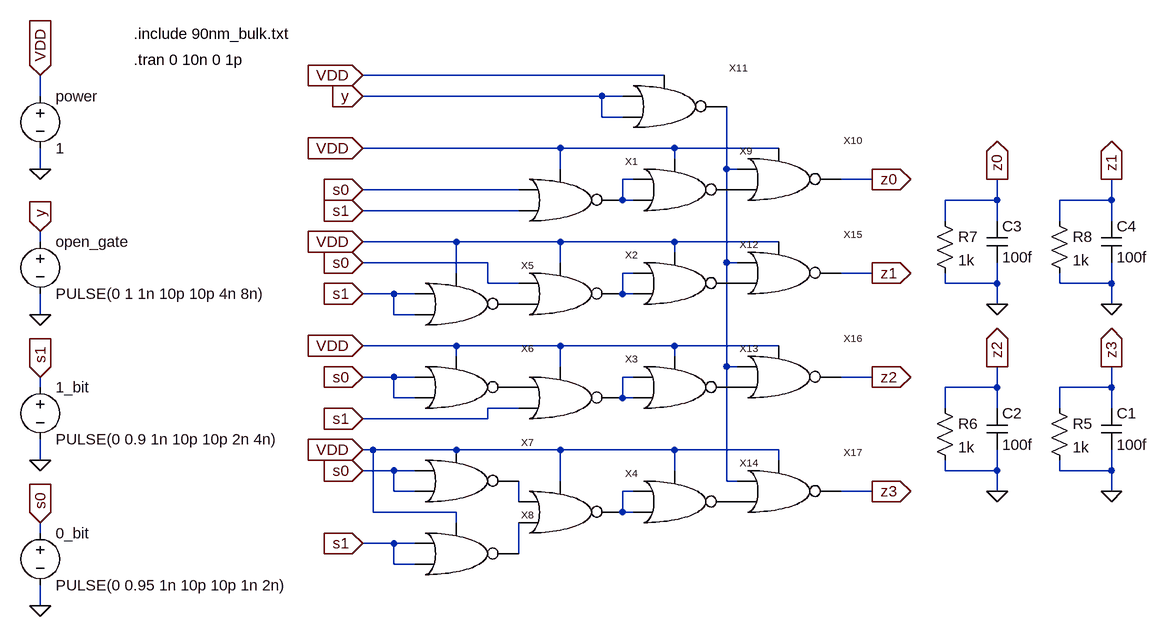
[diagram p0: schematic nor_demultiplexor.asc]
nor_demultiplexor.asc, the LTspice schematic file:
Version 4
SHEET 1 1288 680
WIRE 368 -416 -96 -416
WIRE -592 -384 -592 -416
WIRE 272 -384 -96 -384
WIRE 304 -384 272 -384
WIRE 272 -352 272 -384
WIRE 304 -352 272 -352
WIRE 208 -304 -96 -304
WIRE 384 -304 208 -304
WIRE 544 -304 384 -304
WIRE 384 -288 384 -304
WIRE -592 -272 -592 -304
WIRE 208 -272 208 -304
WIRE 464 -272 464 -368
WIRE 480 -272 464 -272
WIRE 320 -256 304 -256
WIRE 688 -256 640 -256
WIRE 144 -240 -96 -240
WIRE 304 -224 304 -256
WIRE 320 -224 304 -224
WIRE 880 -224 880 -256
WIRE 880 -224 800 -224
WIRE 1056 -224 1056 -256
WIRE 1056 -224 976 -224
WIRE 144 -208 -96 -208
WIRE 800 -192 800 -224
WIRE 880 -192 880 -224
WIRE 976 -192 976 -224
WIRE 1056 -192 1056 -224
WIRE -592 -160 -592 -176
WIRE 48 -160 -96 -160
WIRE 208 -160 48 -160
WIRE 384 -160 208 -160
WIRE 544 -160 384 -160
WIRE 384 -144 384 -160
WIRE 96 -128 -96 -128
WIRE 208 -128 208 -160
WIRE 464 -128 464 -272
WIRE 480 -128 464 -128
WIRE 48 -112 48 -160
WIRE 320 -112 304 -112
WIRE 688 -112 640 -112
WIRE 96 -96 96 -128
WIRE 144 -96 96 -96
WIRE 800 -96 800 -112
WIRE 880 -96 880 -128
WIRE 880 -96 800 -96
WIRE 976 -96 976 -112
WIRE 1056 -96 1056 -128
WIRE 1056 -96 976 -96
WIRE -48 -80 -96 -80
WIRE -16 -80 -48 -80
WIRE 304 -80 304 -112
WIRE 320 -80 304 -80
WIRE 880 -64 880 -96
WIRE 1056 -64 1056 -96
WIRE -592 -48 -592 -80
WIRE -48 -48 -48 -80
WIRE -16 -48 -48 -48
WIRE 48 0 -96 0
WIRE 208 0 48 0
WIRE 384 0 208 0
WIRE 544 0 384 0
WIRE 48 16 48 0
WIRE 384 16 384 0
WIRE 208 32 208 0
WIRE 464 32 464 -128
WIRE 480 32 464 32
WIRE -48 48 -96 48
WIRE -16 48 -48 48
WIRE 320 48 304 48
WIRE 688 48 640 48
WIRE -592 64 -592 48
WIRE 880 64 880 32
WIRE 880 64 800 64
WIRE 1056 64 1056 32
WIRE 1056 64 976 64
WIRE -48 80 -48 48
WIRE -16 80 -48 80
WIRE 304 80 304 48
WIRE 320 80 304 80
WIRE 144 96 96 96
WIRE 800 96 800 64
WIRE 880 96 880 64
WIRE 976 96 976 64
WIRE 1056 96 1056 64
WIRE 96 112 96 96
WIRE 96 112 -96 112
WIRE -80 160 -96 160
WIRE 48 160 -80 160
WIRE 208 160 48 160
WIRE 384 160 208 160
WIRE 544 160 384 160
WIRE -592 176 -592 144
WIRE 544 176 544 160
WIRE -48 192 -96 192
WIRE -16 192 -48 192
WIRE 384 192 384 160
WIRE 800 192 800 176
WIRE 880 192 880 160
WIRE 880 192 800 192
WIRE 976 192 976 176
WIRE 1056 192 1056 160
WIRE 1056 192 976 192
WIRE 208 208 208 160
WIRE 464 208 464 32
WIRE 480 208 464 208
WIRE -48 224 -48 192
WIRE -16 224 -48 224
WIRE 320 224 304 224
WIRE 688 224 640 224
WIRE 880 224 880 192
WIRE 1056 224 1056 192
WIRE 144 240 144 208
WIRE -80 256 -80 160
WIRE 48 256 -80 256
WIRE 304 256 304 224
WIRE 320 256 304 256
WIRE 48 272 48 256
WIRE -592 288 -592 272
WIRE -48 304 -96 304
WIRE -16 304 -48 304
WIRE 144 320 144 272
WIRE -48 336 -48 304
WIRE -16 336 -48 336
WIRE -592 400 -592 368
FLAG -96 -240 s0
IOPIN -96 -240 In
FLAG -96 -208 s1
IOPIN -96 -208 In
FLAG -592 400 0
FLAG -592 176 0
FLAG -592 -48 0
FLAG -96 -384 y
IOPIN -96 -384 In
FLAG -592 -176 y
IOPIN -592 -176 In
FLAG -592 272 s0
IOPIN -592 272 In
FLAG -592 48 s1
IOPIN -592 48 In
FLAG -96 -128 s0
IOPIN -96 -128 In
FLAG -96 -80 s1
IOPIN -96 -80 In
FLAG -592 -272 0
FLAG -592 -416 VDD
IOPIN -592 -416 In
FLAG -96 -304 VDD
IOPIN -96 -304 In
FLAG -96 -160 VDD
IOPIN -96 -160 In
FLAG -96 112 s1
IOPIN -96 112 In
FLAG -96 48 s0
IOPIN -96 48 In
FLAG -96 0 VDD
IOPIN -96 0 In
FLAG -96 192 s0
IOPIN -96 192 In
FLAG -96 304 s1
IOPIN -96 304 In
FLAG -96 160 VDD
IOPIN -96 160 In
FLAG 1056 224 0
FLAG 1056 32 z3
IOPIN 1056 32 Out
FLAG 880 224 0
FLAG 880 32 z2
IOPIN 880 32 Out
FLAG 880 -64 0
FLAG 880 -256 z0
IOPIN 880 -256 Out
FLAG 1056 -64 0
FLAG 1056 -256 z1
IOPIN 1056 -256 Out
FLAG 688 -256 z0
IOPIN 688 -256 Out
FLAG 688 -112 z1
IOPIN 688 -112 Out
FLAG 688 48 z2
IOPIN 688 48 Out
FLAG 688 224 z3
IOPIN 688 224 Out
FLAG -96 -416 VDD
IOPIN -96 -416 In
SYMBOL voltage -592 272 R0
WINDOW 123 0 0 Left 0
WINDOW 39 0 0 Left 0
SYMATTR InstName 0_bit
SYMATTR Value PULSE(0 0.95 1n 10p 10p 1n 2n)
SYMBOL voltage -592 -176 R0
WINDOW 123 0 0 Left 0
WINDOW 39 0 0 Left 0
SYMATTR InstName open_gate
SYMATTR Value PULSE(0 1 1n 10p 10p 4n 8n)
SYMBOL voltage -592 48 R0
WINDOW 123 0 0 Left 0
WINDOW 39 0 0 Left 0
SYMATTR InstName 1_bit
SYMATTR Value PULSE(0 0.9 1n 10p 10p 2n 4n)
SYMBOL nor_gate 192 -224 R0
SYMATTR InstName X1
SYMBOL nor_gate 192 -80 R0
SYMATTR InstName X2
SYMBOL nor_gate 192 80 R0
SYMATTR InstName X3
SYMBOL nor_gate 192 256 R0
SYMATTR InstName X4
SYMBOL nor_gate 32 -64 R0
SYMATTR InstName X5
SYMBOL voltage -592 -400 R0
WINDOW 123 0 0 Left 0
WINDOW 39 0 0 Left 0
SYMATTR InstName power
SYMATTR Value 1
SYMBOL nor_gate 32 64 R0
SYMATTR InstName X6
SYMBOL nor_gate 32 208 R0
SYMATTR InstName X7
SYMBOL nor_gate 32 320 R0
SYMATTR InstName X8
SYMBOL nor_gate 368 -240 R0
SYMATTR InstName X9
SYMBOL nor_gate 528 -256 R0
SYMATTR InstName X10
SYMBOL nor_gate 352 -368 R0
SYMATTR InstName X11
SYMBOL nor_gate 368 -96 R0
SYMATTR InstName X12
SYMBOL nor_gate 368 64 R0
SYMATTR InstName X13
SYMBOL nor_gate 368 240 R0
SYMATTR InstName X14
SYMBOL nor_gate 528 -112 R0
SYMATTR InstName X15
SYMBOL nor_gate 528 48 R0
SYMATTR InstName X16
SYMBOL nor_gate 528 224 R0
SYMATTR InstName X17
SYMBOL res 960 80 R0
SYMATTR InstName R5
SYMATTR Value 1k
SYMBOL cap 1040 96 R0
SYMATTR InstName C1
SYMATTR Value 100f
SYMBOL res 784 80 R0
SYMATTR InstName R6
SYMATTR Value 1k
SYMBOL cap 864 96 R0
SYMATTR InstName C2
SYMATTR Value 100f
SYMBOL res 784 -208 R0
SYMATTR InstName R7
SYMATTR Value 1k
SYMBOL cap 864 -192 R0
SYMATTR InstName C3
SYMATTR Value 100f
SYMBOL res 960 -208 R0
SYMATTR InstName R8
SYMATTR Value 1k
SYMBOL cap 1040 -192 R0
SYMATTR InstName C4
SYMATTR Value 100f
TEXT -448 -480 Left 2 !.include 90nm_bulk.txt
TEXT -448 -440 Left 2 !.tran 0 10n 0 1p

The netlist it stands for:
* nor_demultiplexor.asc
V§0_bit s0 0 PULSE(0 0.95 1n 10p 10p 1n 2n)
V§open_gate y 0 PULSE(0 1 1n 10p 10p 4n 8n)
V§1_bit s1 0 PULSE(0 0.9 1n 10p 10p 2n 4n)
XX1 s0 s1 VDD N002 nor_gate  ; pins A B VDD R
XX2 s0 P001 VDD N003 nor_gate  ; pins A B VDD R
XX3 P002 s1 VDD N004 nor_gate  ; pins A B VDD R
XX4 N006 N007 VDD N005 nor_gate  ; pins A B VDD R
XX5 s1 s1 VDD P001 nor_gate  ; pins A B VDD R
V§power VDD 0 1
XX6 s0 s0 VDD P002 nor_gate  ; pins A B VDD R
XX7 s0 s0 VDD N006 nor_gate  ; pins A B VDD R
XX8 s1 s1 VDD N007 nor_gate  ; pins A B VDD R
XX9 N002 N002 VDD P003 nor_gate  ; pins A B VDD R
XX10 N001 P003 VDD z0 nor_gate  ; pins A B VDD R
XX11 y y VDD N001 nor_gate  ; pins A B VDD R
XX12 N003 N003 VDD P004 nor_gate  ; pins A B VDD R
XX13 N004 N004 VDD P005 nor_gate  ; pins A B VDD R
XX14 N005 N005 VDD P006 nor_gate  ; pins A B VDD R
XX15 N001 P004 VDD z1 nor_gate  ; pins A B VDD R
XX16 N001 P005 VDD z2 nor_gate  ; pins A B VDD R
XX17 N001 P006 VDD z3 nor_gate  ; pins A B VDD R
R5 z3 0 1k
C1 z3 0 100f
R6 z2 0 1k
C2 z2 0 100f
R7 z0 0 1k
C3 z0 0 100f
R8 z1 0 1k
C4 z1 0 100f
.include 90nm_bulk.txt
.tran 0 10n 0 1p
.backanno
.end